# EAGLE design ADC_v1 (EAGLE 7.1.0)
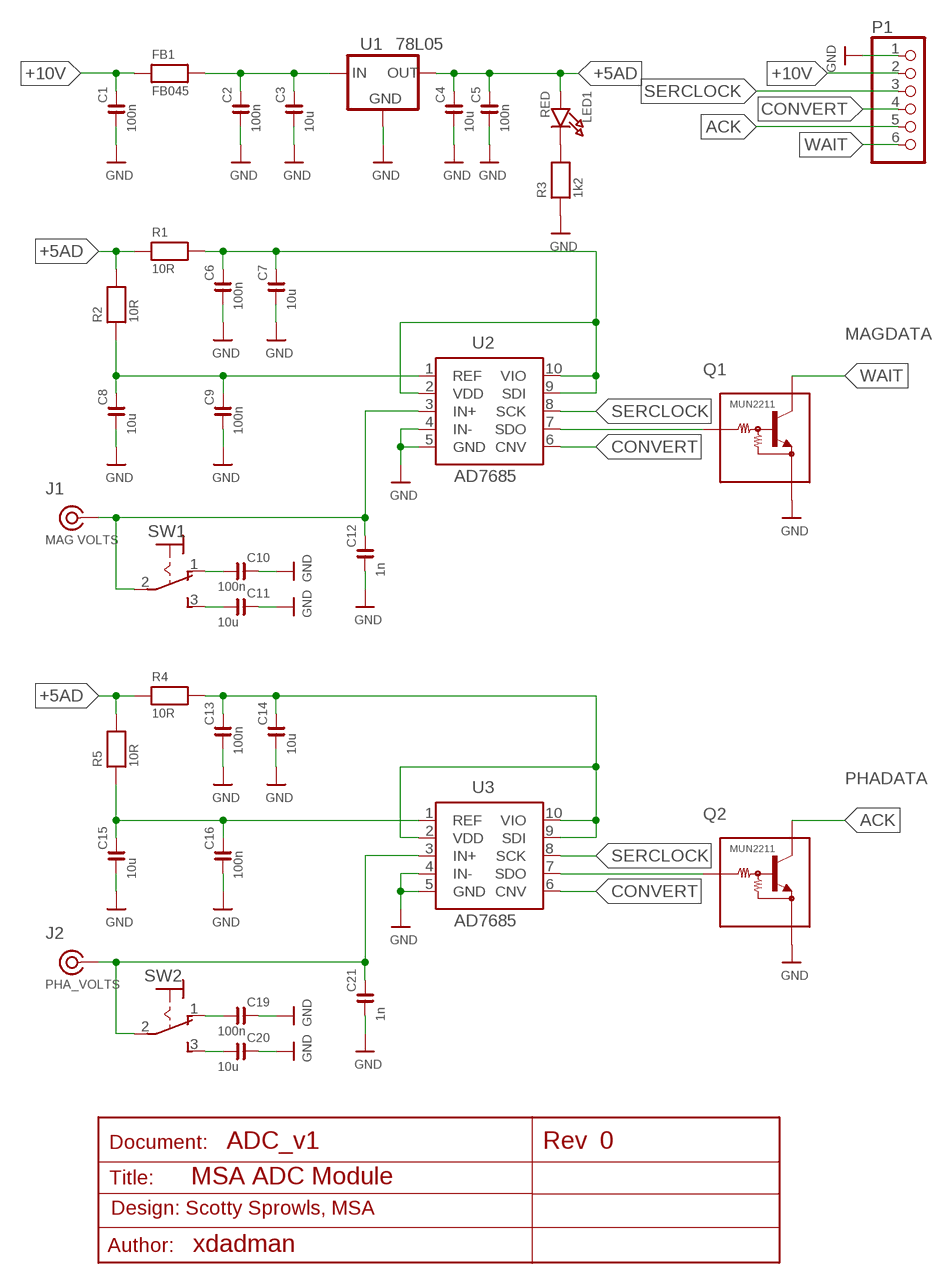
[diagram p0: schematic, sheet 1]

## Parts
C1  100n  C0805100N  [C0805]
C2  100n  C0805100N  [C0805]
C3  10u  CC120610U  [C1206]
C4  10u  CC120610U  [C1206]
C5  100n  C0805100N  [C0805]
C6  100n  C0805100N  [C0805]
C7  10u  CC120610U  [C1206]
C8  10u  CC120610U  [C1206]
C9  100n  C0805100N  [C0805]
C10  100n  C0805100N  [C0805]
C11  10u  CC120610U  [C1206]
C12  1n  C08051N  [C0805]
C13  100n  C0805100N  [C0805]
C14  10u  CC120610U  [C1206]
C15  10u  CC120610U  [C1206]
C16  100n  C0805100N  [C0805]
C19  100n  C0805100N  [C0805]
C20  10u  CC120610U  [C1206]
C21  1n  C08051N  [C0805]
FB1  FB045  R0805FB045  [R0805]
J1  MAG VOLTS  COAX  [SLIM_COAX_PAD]
J2  PHA_VOLTS  COAX  [SLIM_COAX_PAD]
LED1  RED  LED_0603_RED0603  [CHIPLED_0603]
P1  PINHD-1X6  [1X06]
Q1  MUN2211  [SOT23]
Q2  MUN2211  [SOT23]
R1  10R  R080510R  [R0805]
R2  10R  R080510R  [R0805]
R3  1k2  R08051K2  [R0805]
R4  10R  R080510R  [R0805]
R5  10R  R080510R  [R0805]
SW1  SWITCH1AS3  [1AS3T2B4M2RE]
SW2  SWITCH1AS3  [1AS3T2B4M2RE]
U1  78L05  78MXXL78L05  [SOT89]
U2  AD7685  [MSOP10]
U3  AD7685  [MSOP10]

## Nets
+5AD: C4.2 C5.2 LED1.A R1.1 R2.2 R4.1 R5.2 U1.1(OUT)
+10V: C1.2 FB1.1 P1.2
ACK: P1.5 Q2.C
CONVERT: P1.4 U2.6(CNV) U3.6(CNV)
GND: C1.1 C2.1 C3.1 C4.1 C5.1 C6.1 C7.1 C8.1 C9.1 C10.2 C11.2 C12.1 C13.1 C14.1 C15.1 C16.1 C19.2 C20.2 C21.1 P1.1 Q1.E Q2.E R3.1 U1.2(GND) U1.4(GND) U2.4(IN-) U2.5(GND) U3.4(IN-) U3.5(GND)
N$1: C2.2 C3.2 FB1.2 U1.3(IN)
N$2: C8.2 C9.2 R2.1 U2.1(REF)
N$3: C6.2 C7.2 R1.2 U2.2(VDD) U2.9(SDI) U2.10(VIO)
N$4: LED1.C R3.2
N$6: Q1.B U2.7(SDO)
N$7: C15.2 C16.2 R5.1 U3.1(REF)
N$8: C12.2 J1.SIG SW1.2(P) U2.3(IN+)
N$9: C11.1 SW1.3(S)
N$10: C10.1 SW1.1(O)
N$11: C13.2 C14.2 R4.2 U3.2(VDD) U3.9(SDI) U3.10(VIO)
N$12: Q2.B U3.7(SDO)
N$13: C21.2 J2.SIG SW2.2(P) U3.3(IN+)
N$14: C20.1 SW2.3(S)
N$15: C19.1 SW2.1(O)
SERCLOCK: P1.3 U2.8(SCK) U3.8(SCK)
WAIT: P1.6 Q1.C

## Notes on the sheet
- MAGDATA
- PHADATA
- 0
- MSA ADC Module
- Design: Scotty Sprowls, MSA
- xdadman

## Power pins joined to a net without a drawn wire
GND: J1.GND J2.GND

## Library data of the parts
C1 C2 C5 C6 C9 C10 C13 C16 C19 = MSA_lib:C0805: Ceramic capacitor; OC_FARNELL: 1759166
C3 C4 C7 C8 C11 C14 C15 C20 = MSA_lib:CC1206: Capacitor ceramic 1206; OC_FARNELL: 1611967
C12 C21 = MSA_lib:C0805: Ceramic capacitor; OC_FARNELL: 1833879
FB1 = MSA_lib:R0805: Resistors; OC_FARNELL: 1515661
J1 J2 = MSA_lib:COAX
LED1 = MSA_lib:LED_0603_RED: Chip LED 0603 RED 2ma; OC_FARNELL: 1685068
P1 = MSA_lib:PINHD-1X6: PIN HEADER
Q1 Q2 = MSA_lib:MUN2211*: NPN Bias Resistor Transistor; OC_FARNELL: 9556648
R1 R2 R4 R5 = MSA_lib:R0805: Resistors; OC_FARNELL: 2332043
R3 = MSA_lib:R0805: Resistors; OC_FARNELL: 9333827
SW1 SW2 = MSA_lib:SWITCH: TOGGLE SWITCH Marquardt; OC_FARNELL: 1550149
U1 = MSA_lib:78MXXL: VOLTAGE REGULATOR; OC_FARNELL: 1366573
U2 U3 = MSA_lib:AD7685; OC_FARNELL: 1078337

## Board

Size 32 x 32 mm. Coordinates in mm from the lower left corner, seen from the top.
Outline: 0,0 32,0 32,32 0,32 0,0
Copper layers (1*16): Top 0.035mm / dielectric 1.5mm / Bottom 0.035mm
Design rules "kuba_no_CLR": minimum track width 8mil, minimum drill 15mil, track to track 8mil, track to pad 8mil, pad to pad 8mil, via to via 8mil, smd to smd 8mil, copper to edge 0mil, drill to drill 8mil, minimum pad ring 12mil, minimum via ring 10mil, stop-mask expansion 4mil, vias tented up to drill 0mil, thermal gap 10mil

### Footprints (pad centres in the part's own frame; a part is rotated, then mirrored left to right if it is on the bottom)
C0805 = smd 1.2 x 1.5: 1 -0.953,0; 2 0.953,0
C1206 = smd 1.6 x 1.8: 1 -1.4,0; 2 1.4,0
R0805 = smd 1.3 x 1.5: 1 -0.95,0; 2 0.95,0
SLIM_COAX_PAD = smd 1.27 x 0.635 bottom: GND 0,-2.667 | drill 1.1: SIG 0,0
CHIPLED_0603 = smd 0.8 x 0.8: A 0,-0.75; C 0,0.75
1X06 = drill 1.016: 1 -6.35,0; 2 -3.81,0; 3 -1.27,0; 4 1.27,0; 5 3.81,0; 6 6.35,0
SOT23 = smd 0.8 x 0.9: B 0.95,1; C 0,-1; E -0.95,1
1AS3T2B4M2RE = drill 1 pad 2: 1 -2.54,0; 2 0,0; 3 2.54,0
SOT89 = smd 1.2 x 1.5: 1 -1.6,-2; 3 1.6,-2 | smd 1 x 1.5: 2 0,-2 | smd 2.4 x 3: 4 0,1.25
MSOP10 = smd 0.29 x 1.04: 1 -1,-2.2; 2 -0.5,-2.2; 3 0,-2.2; 4 0.5,-2.2; 5 1,-2.2; 6 1,2.2; 7 0.5,2.2; 8 0,2.2; 9 -0.5,2.2; 10 -1,2.2

### Placement (x,y rotation side)
C1  4.32,7.75 180 top
C2  9.02,3.81 90 top
C3  4.32,3.68 0 top
C4  18.03,4.45 90 top
C5  16,3.81 90 top
C6  20.95,8.76 180 top
C7  21.59,10.67 180 top
C8  26.92,13.97 270 top
C9  26.04,10.54 0 top
C10  21.59,22.86 270 top
C11  26.92,19.05 270 top
C12  23.24,20.07 0 top
C13  8.13,8.76 180 top
C14  8.76,10.67 180 top
C15  12.57,8.76 0 top
C16  13.21,10.79 0 top
C19  9.4,23.11 270 top
C20  16.51,21.59 270 top
C21  13.08,20.07 180 top
FB1  4.32,5.71 0 top
J1  24,18.03 90 top
J2  11.56,18.16 90 top
LED1  22.35,6.1 270 top
P1  4.57,16.51 90 top
Q1  6.1,25.15 270 top
Q2  6.86,20.32 270 top
R1  19.94,5.97 90 top
R2  27.05,7.62 270 top
R3  24.64,7.62 270 top
R4  8.13,6.99 180 top
R5  16,8 270 top
SW1  23.24,26.16 0 top
SW2  11.94,26.29 0 top
U1  12.45,4.14 180 top
U2  22.48,13.34 90 top
U3  10.79,13.34 90 top

### Tracks (layer width: path | path; a pad name or v marks a point on that pad's centre or on a via)
+5AD
  Top 0.406: LED1.A 21.84,6.1 21.84,5.02
  Top 0.508: 14.05,6.66 13.34,7.37 9.46,7.37
  Top 0.61: 9.46,7.37 R4.1
  Top 0.813: R2.2 25.4,5.02 21.84,5.02 R1.1 19.7,5.26 19.05,5.26 18.46,5.84 C4.2 16,5.84 | R5.2 16,5.97 | 16,5.97 16,5.84 | 16,5.84 C5.2 | 14.05,6.66 U1.1 | U1.1 14.05,6.02 14.1,5.97 | 16,5.97 15.62,5.97 15.49,6.1 14.09,6.1 U1.1
+10V
  Top 0.406: C1.2 3.37,9.46 3.05,9.78 3.05,11.18 P1.2
  Top 0.813: FB1.1 C1.2
ACK
  Top 0.813: Q2.C P1.5
CONVERT
  Top 0.254: U2.6 18.94,14.34 18.41,14.86 18.41,25.27 15.49,28.19 6.73,28.19 5.97,27.43 5.97,23.75 6.86,22.86 6.86,19.68 5.08,17.91 4.7,17.91 P1.4 | U3.6 8.02,14.34
  Top 0.305: 8.02,14.34 P1.4
GND  (via drill 0.5)
  Top 0.203: 24.96,10.67 24.64,10.67 v24.13,10.16
  Top 0.254: 14.1,20 14.1,16.26 12.99,15.15 U3.5 U3.4 | 14.1,20 C21.1 | 14.1,20 16.32,20 C20.2 | U2.5 25.89,14.34 C8.1
  Top 0.406: Q1.E 7.1,26.65 v7.11,26.67 | 23.11,9.65 23.11,9.14 23.62,8.64 24.57,8.64 R3.1
  Top 0.813: Q2.E 8.51,21.27 | 8.51,21.27 C19.2 | C12.1 22.29,21.21 | 22.29,21.21 C10.2 | C8.1 C11.2 | 24.96,10.67 C9.1 | 23.11,10.54 C7.1 | C16.1 10.29,10.79 C14.1 | C1.1 5.27,9.46 P1.1 | 8.51,21.27 8.82,21.27 v8.89,21.34 | 14.1,20 14.1,18.29 J2.GND | v12.45,6.35 U1.2 | 22.29,21.21 21.84,21.21 v21.59,20.95
  Top 1.016: C7.1 24.96,10.67 | C6.1 22.23,8.76 23.11,9.65 23.11,10.54
  Bottom 0.406: v7.11,26.67 7.11,26.92
  other vias: 2.03,29.97 8.13,29.97 14.22,29.97 19.56,29.97 2.03,25.4 2.03,14.73 2.03,10.16 1.78,6.86 2.03,1.78 1.78,4.06 7.62,1.78 12.95,1.78 18.8,1.78 24.38,1.78 29.97,1.78 29.97,5.59 29.97,9.65 30.23,20.32 29.97,25.4 29.97,29.72 24.38,29.97 30.23,14.73 2.03,19.56 25.4,14.99 10.92,9.78 13.97,14.99
  pour Top (no thermals): 0,0 32,0 32,32 0,32 0,2.54 2.67,2.41 2.67,28.96 29.34,28.96 29.34,2.29 0,2.41
  pour Top (no thermals): 12.95,13.84 14.1,13.84 17.27,17.53 17.27,20.7 13.59,20.7 13.59,15.75 12.95,15.11
  pour Bottom: 0,0 32,0 32,32 0,32
  pour Top (no thermals): 24.31,13.77 25.4,13.79 26.16,14.48 29.46,14.48 29.46,18.29 25.91,18.29 25.91,16.26 24.31,14.96
  pour Top (no thermals): 9.09,7.92 12.04,7.92 12.06,8.2 12.06,11.1 11.89,11.53 9.53,11.53 9.47,11.23 9.47,9.47 9.14,9.14 9.14,8.23
N$1
  Top 0.813: U1.3 10.67,5.96 10.67,5.46 9.97,4.76 C2.2 6.8,4.76 C3.2 5.27,4.13 FB1.2
N$2
  Top 0.254: U2.1 24.75,12.34 24.89,12.19
  Top 0.406: 24.89,12.19 26.55,12.19 C8.2
  Top 0.813: C8.2 26.92,10.6 C9.2 26.99,8.63 R2.1
N$3
  Top 0.254: C7.2 20.19,12.25 U2.10
  Top 0.305: U2.2 U2.9 U2.10
  Top 0.813: 19.94,8.7 C6.2 | 20,10.48 C7.2
  Top 1.016: R1.2 19.94,8.7 | C6.2 20,10.48
  pour Top (no thermals): 19.96,12.73 20.83,12.75 20.83,10.85 19.48,10.85 19.46,10.87 19.46,11.43 19.76,11.73 19.76,12.7 19.79,12.73
N$4
  Top 0.406: LED1.C 24.64,6.1 R3.2
N$6
  Top 0.254: U2.7 18.68,13.84 17.91,14.61
  Top 0.305: 17.91,14.61 17.91,25.02 15.24,27.69 8.76,27.69 8,26.92 8,25.1 Q1.B
N$7
  Top 0.254: U3.1 13.57,12.34 13.72,12.19 13.84,12.06
  Top 0.508: 13.72,12.19 14.1,11.81 14.1,10.86 C16.2
  Top 0.813: R5.1 15.81,8.76 C15.2 13.97,10.61 C16.2
N$8
  Top 0.254: U2.3 23.75,13.34 23.62,13.46
  Top 0.305: 23.62,13.46 23.37,13.72
  Top 0.813: 23.37,13.72 23.37,17.4 J1.SIG
  Top 1.016: J1.SIG 24,18.92 24.38,19.3 24.38,19.88 C12.2 24.19,21.02 23.37,21.84 23.37,26.04 SW1.2
N$9
  Top 0.813: C11.1 26.92,25.02 SW1.3
N$10
  Top 0.813: C10.1 21.59,24.13 20.57,25.15 20.57,26.04 SW1.1
N$11
  Top 0.254: U3.9 U3.2
  Top 0.305: U3.9 7.88,12.84 7.75,12.7 7.75,12.19 | 7.75,12.19 7.75,11.05 C14.2 | U3.10 7.89,12.34 7.75,12.19
  Top 0.61: 7.37,11.18 7.37,12.32 7.75,12.7
  Top 0.813: R4.2 C13.2 7.18,10.48 C14.2
N$12
  Top 0.254: U3.7 9.64,13.84
  Top 0.305: 9.64,13.84 9.78,13.97 9.78,15.37 8.51,16.64 8.51,18.72 Q2.B
N$13
  Top 0.254: U3.3 12.06,13.34 11.94,13.46
  Top 0.406: 11.94,13.46 11.68,13.72
  Top 0.813: 11.68,13.72 11.68,18.03 J2.SIG
  Top 1.016: J2.SIG 11.56,18.54 12.19,19.18 12.19,20 C21.2 12.13,26.1 SW2.2
N$14
  Top 1.016: C20.1 16.51,24.26 SW2.3
N$15
  Top 0.813: SW2.1 C19.1
SERCLOCK
  Top 0.254: U2.8 21.08,13.34 21.46,13.72 21.46,14.86 18.92,17.4 18.92,25.53 15.75,28.7 6.48,28.7 3.17,25.4 3.17,16.64 P1.3 4.95,14.86 6.22,14.86 7.75,13.34 U3.8
WAIT
  Top 0.813: Q1.C 4.7,25.15 4.57,25.02 P1.6

### Text on the board
tPlace: SW2 PHA | SW1 MAG | Q1 | C20 | C19 | Q2 | C11 | C21 | C10 | C12 | P1 | J2-PHAV | J1-MAGV | U3 | U2 | C14 | C16 | C8 | C15 | C7\ | C9 | R5 | C6 | C4 | R1 | R3 | R2 | R4 | C2 | ADC 16 | C3 | C5 | LED1